# EAGLE design main (EAGLE 6.5.0)
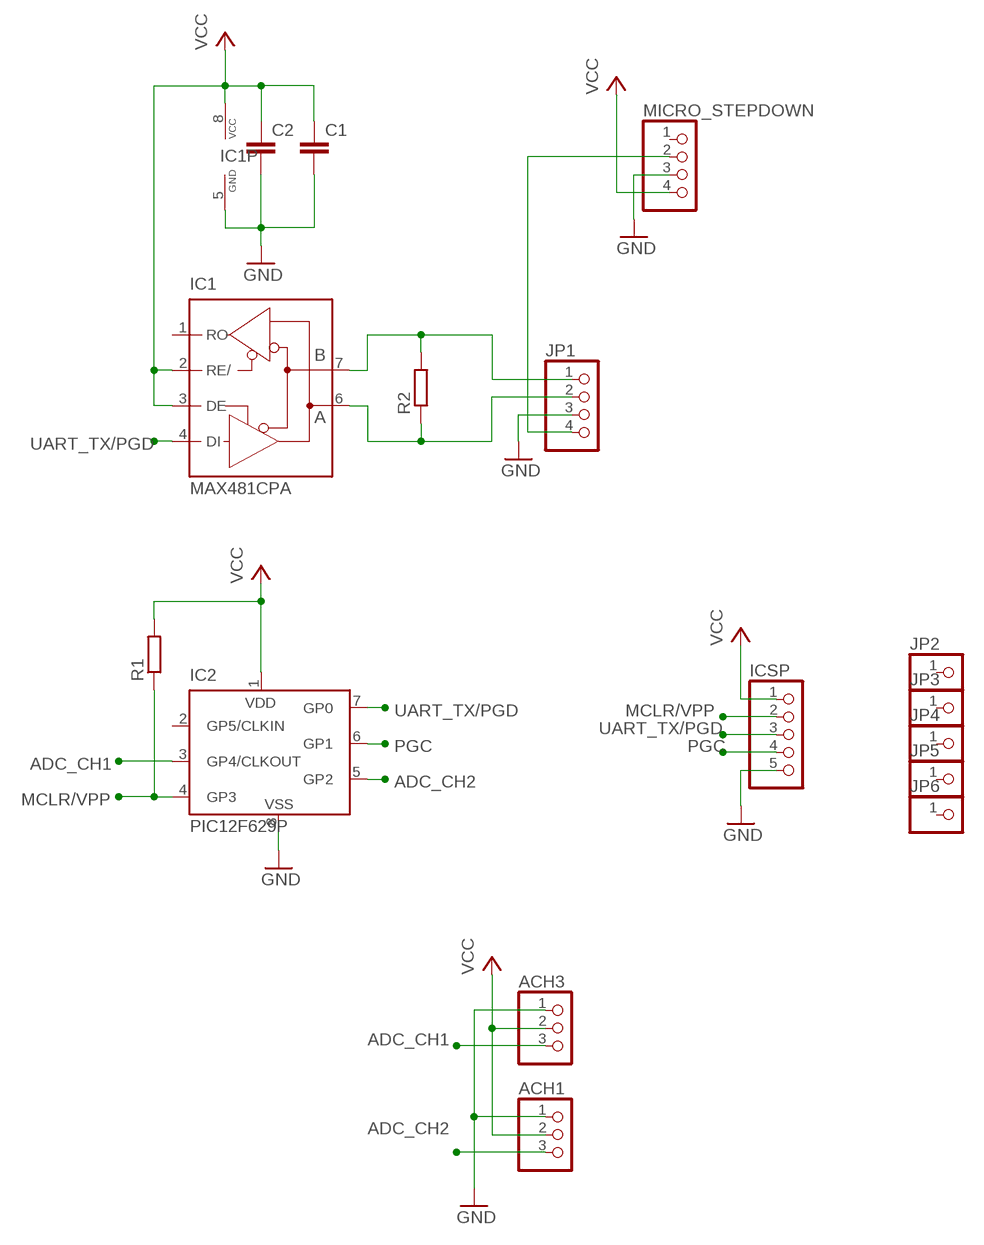
[diagram p0: schematic, sheet 1]

## Parts
ACH1  PINHD-1X3  [1X03]
ACH3  PINHD-1X3  [1X03]
C1  C-EUC0603  [C0603]
C2  C-EUC0603  [C0603]
IC1  MAX481CPA  [DIL08]
IC2  PIC12F629P  [DIL8]
ICSP  PINHD-1X5  [1X05]
JP1  PINHD-1X4  [1X04]
JP2  PINHD-1X1  [1X01]
JP3  PINHD-1X1  [1X01]
JP4  PINHD-1X1  [1X01]
JP5  PINHD-1X1  [1X01]
JP6  PINHD-1X1  [1X01]
MICRO_STEPDOWN  PINHD-1X4/90  [1X04/90]
R1  R-EU_R0603  [R0603]
R2  R-EU_R0603  [R0603]

## Nets
ADC_CH1: ACH3.3 IC2.3(GP4/CLKOUT)
ADC_CH2: ACH1.3 IC2.5(GP2)
GND: ACH1.1 ACH3.1 C1.2 C2.2 IC1.5(GND) IC2.8(VSS) ICSP.5 JP1.3 MICRO_STEPDOWN.3
MCLR/VPP: IC2.4(GP3) ICSP.2 R1.1
N$1: IC1.7(B) JP1.1 R2.2
N$2: IC1.6(A) JP1.2 R2.1
N$3: JP1.4 MICRO_STEPDOWN.2
PGC: IC2.6(GP1) ICSP.4
UART_TX/PGD: IC1.4(DI) IC2.7(GP0) ICSP.3
VCC: ACH1.2 ACH3.2 C1.1 C2.1 IC1.2(RE/) IC1.3(DE) IC1.8(VCC) IC2.1(VDD) ICSP.1 MICRO_STEPDOWN.4 R1.2
Unconnected: IC1.1(RO) IC2.2(GP5/CLKIN) JP2.1 JP3.1 JP4.1 JP5.1 JP6.1 MICRO_STEPDOWN.1

## Library data of the parts
ACH1 ACH3 = pinhead:PINHD-1X3: PIN HEADER
C1 C2 = rcl:C-EU: CAPACITOR, European symbol
IC1 = maxim:MAX481CPA: RS485 TRANSEIVER; MPN: MAX481CPA+; OC_FARNELL: unknown; OC_NEWARK: 99K3445
IC2 = microchip:PIC12F6*: Data Sheet 8-Pin FLASH-Based 8-Bit CMOS Microcontrollers Source: http://www.microchip.com .. 41190c.pdf; MF: MICROCHIP; MPN: PIC12F629-I/P; OC_FARNELL: 1292253; OC_NEWARK: 67K0822
ICSP = pinhead:PINHD-1X5: PIN HEADER
JP1 MICRO_STEPDOWN = pinhead:PINHD-1X4: PIN HEADER
JP2-JP6 = pinhead:PINHD-1X1: PIN HEADER
R1 R2 = rcl:R-EU_: RESISTOR, European symbol

## Board
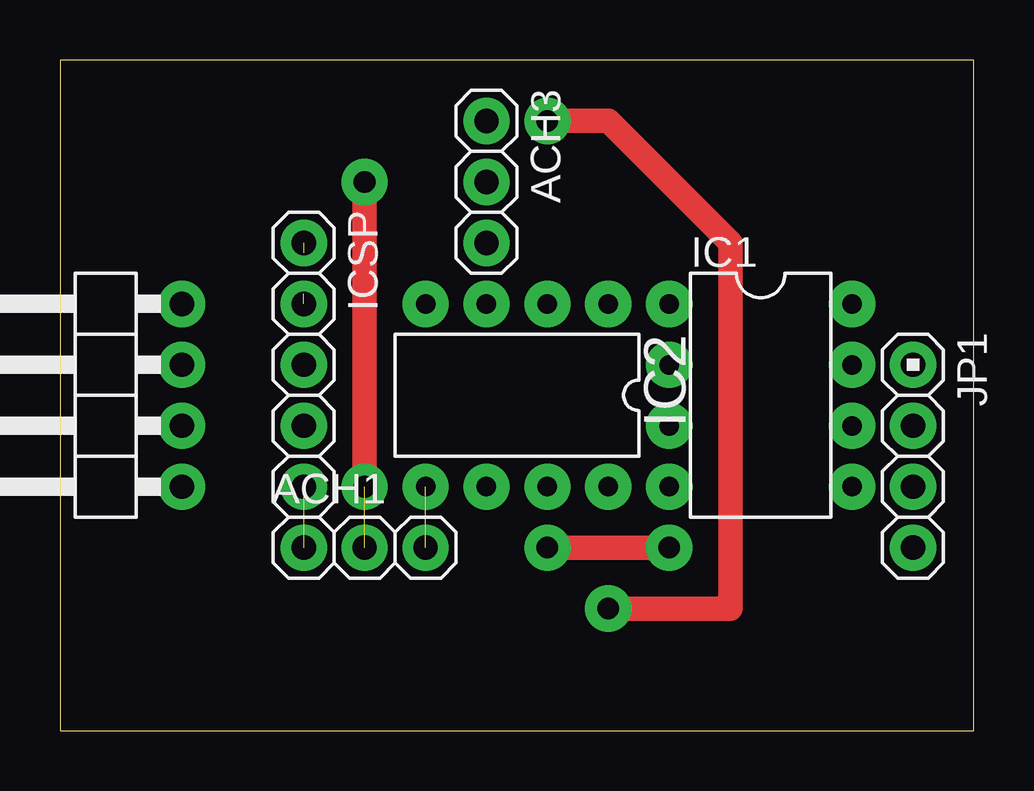
[diagram p1: board, top side]
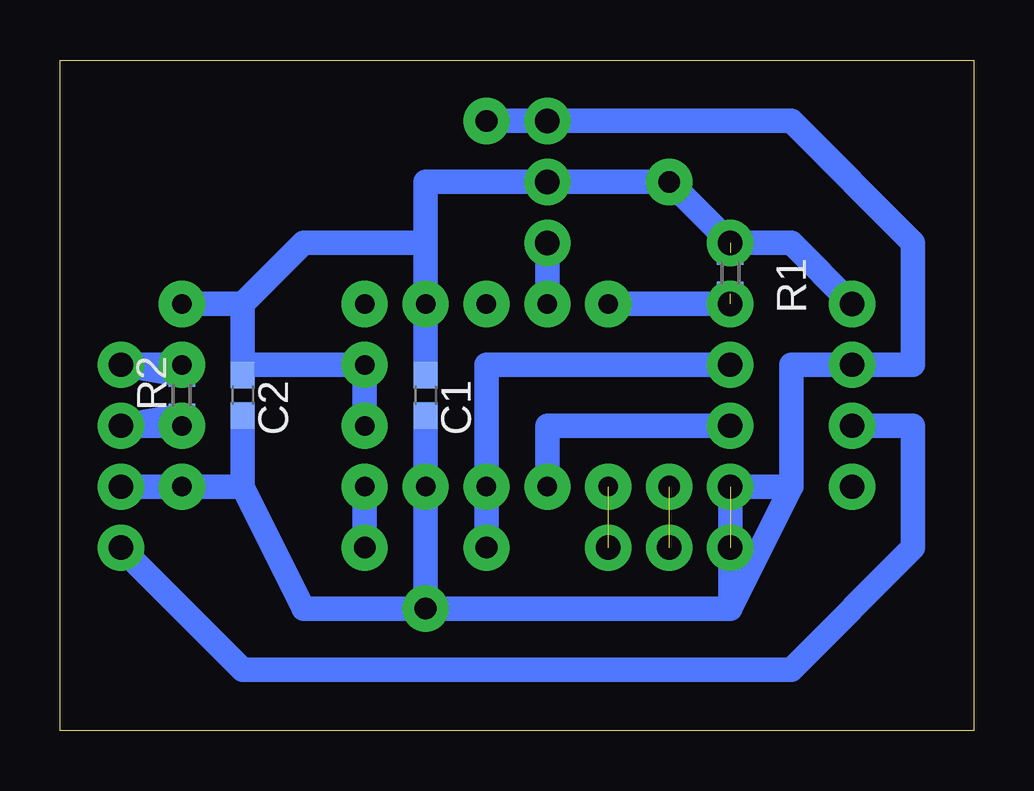
[diagram p2: board, bottom side, seen from below]

Size 38.1 x 27.94 mm. Coordinates in mm from the lower left corner, seen from the top.
Outline: 0,0 38.1,0 38.1,27.94 0,27.94 0,0
Copper layers (1*16): Top 0.035mm / dielectric 1.5mm / Bottom 0.035mm
Design rules "default": minimum track width 10mil, minimum drill 24mil, track to track 8mil, track to pad 8mil, pad to pad 8mil, via to via 8mil, smd to smd 8mil, copper to edge 40mil, drill to drill 8mil, minimum pad ring 10mil, minimum via ring 8mil, stop-mask expansion 4mil, vias tented up to drill 0mil, thermal gap 10mil

### Footprints (pad centres in the part's own frame; a part is rotated, then mirrored left to right if it is on the bottom)
1X03 = drill 1.016 pad 1.93: 1 -2.54,0; 2 0,0; 3 2.54,0
C0603 = smd 1.1 x 1: 1 -0.85,0; 2 0.85,0
DIL08 = drill 0.813 pad 1.93: 1 -3.81,-3.81; 2 -1.27,-3.81; 3 1.27,-3.81; 4 3.81,-3.81; 5 3.81,3.81; 6 1.27,3.81; 7 -1.27,3.81; 8 -3.81,3.81
DIL8 = drill 0.813 pad 1.93: 1 -3.81,-3.81; 2 -1.27,-3.81; 3 1.27,-3.81; 4 3.81,-3.81; 5 3.81,3.81; 6 1.27,3.81; 7 -1.27,3.81; 8 -3.81,3.81
1X05 = drill 1.016 pad 1.93: 1 -5.08,0; 2 -2.54,0; 3 0,0; 4 2.54,0; 5 5.08,0
1X04 = drill 1.016 pad 1.93: 1 -3.81,0; 2 -1.27,0; 3 1.27,0; 4 3.81,0
1X01 = drill 1.016 octagon: 1 0,0
1X04/90 = drill 1.016 pad 1.93: 1 -3.81,-3.81; 2 -1.27,-3.81; 3 1.27,-3.81; 4 3.81,-3.81
R0603 = smd 1 x 1.1: 1 -0.85,0; 2 0.85,0

### Placement (x,y rotation side)
ACH1  12.7,7.62 0 top
ACH3  17.78,22.86 270 top
C1  22.86,13.97 270 bottom
C2  30.48,13.97 270 bottom
IC1  29.21,13.97 270 top
IC2  19.05,13.97 180 top
ICSP  10.16,15.24 270 top
JP1  35.56,11.43 270 top
JP2  -5.08,-5.08 0 top  (outside the outline)
JP3  -5.08,-10.16 0 top  (outside the outline)
JP4  -5.08,-15.24 0 top  (outside the outline)
JP5  -5.08,-20.32 0 top  (outside the outline)
JP6  -5.08,-25.4 0 top  (outside the outline)
MICRO_STEPDOWN  1.27,13.97 90 top
R1  10.16,19.05 90 bottom
R2  33.02,13.97 90 bottom

### Tracks (layer width: path | path; a pad name or v marks a point on that pad's centre or on a via)
ADC_CH1
  Bottom 1.016: ACH3.3 IC2.3
ADC_CH2  (1 unrouted)
GND  (via drill 0.9 pad 1.93)  (1 unrouted)
  Top 1.016: v22.86,5.08 27.94,5.08 27.94,20.32 22.86,25.4 v20.32,25.4
  Bottom 1.016: C1.2 IC2.8 v22.86,5.08 | C2.2 30.48,10.16 | 30.48,10.16 IC1.5 JP1.3 | v22.86,5.08 10.16,5.08 | 10.16,5.08 ICSP.5 7.62,10.16 | v22.86,5.08 27.94,5.08 30.48,10.16 | 7.62,10.16 7.62,15.24 MICRO_STEPDOWN.3 2.54,15.24 2.54,20.32 7.62,25.4 ACH3.1 v20.32,25.4 | 10.16,5.08 7.62,10.16
MCLR/VPP  (1 unrouted)
  Bottom 1.016: ICSP.2 IC2.4
N$1
  Bottom 1.016: IC1.7 JP1.1 R2.2
N$2
  Bottom 1.016: IC1.6 JP1.2 R2.1
N$3
  Bottom 1.016: MICRO_STEPDOWN.2 2.54,12.7 2.54,7.62 7.62,2.54 30.48,2.54 JP1.4
PGC
  Bottom 1.016: IC2.6 17.78,12.7 ICSP.4
UART_TX/PGD  (via drill 0.9 pad 1.93)
  Top 1.016: v25.4,7.62 v20.32,7.62
  Bottom 1.016: v20.32,7.62 IC2.7 20.32,15.24 ICSP.3 | v25.4,7.62 IC1.4
VCC  (via drill 0.9 pad 1.93)  (2 unrouted)
  Top 1.016: v12.7,10.16 v12.7,22.86
  Bottom 0.406: 30.48,15.24 C2.1
  Bottom 1.016: 22.86,20.32 IC2.1 C1.1 | IC1.3 IC1.2 30.48,15.24 30.48,17.78 | 30.48,17.78 IC1.8 | 22.86,20.32 27.94,20.32 30.48,17.78 | MICRO_STEPDOWN.4 7.62,20.32 ICSP.1 v12.7,22.86 ACH3.2 22.86,22.86 22.86,20.32